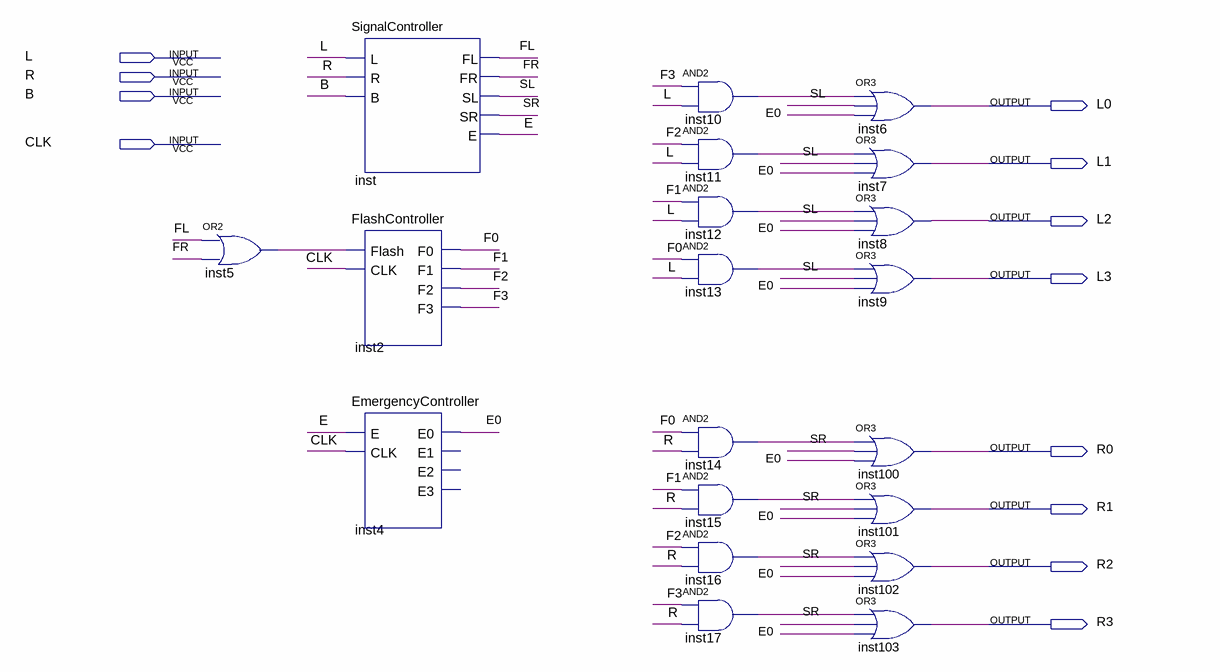
[diagram p0: schematic sheet]
// Quartus schematic MainControlUnit.bdf as structural Verilog: 20 symbols, 12 pins
module MainControlUnit (
  input  L,
  input  R,
  input  B,
  input  CLK,
  output L0,
  output L1,
  output L2,
  output L3,
  output R0,
  output R1,
  output R2,
  output R3
);

  wire E, E0, F0, F1, F2, F3, FL, FR, inst5_out, inst10_out, inst11_out, inst12_out, inst13_out, inst14_out,
       inst15_out, inst16_out, inst17_out, SL, SR;

  or inst5 (inst5_out, FL, FR);
  SignalController inst (.L(L), .R(R), .B(B), .FL(FL), .FR(FR), .SL(SL), .SR(SR), .E(E));
  FlashController inst2 (.Flash(inst5_out), .CLK(CLK), .F0(F0), .F1(F1), .F2(F2), .F3(F3));
  EmergencyController inst4 (.E(E), .CLK(CLK), .E0(E0));  // open: E1, E2, E3
  and inst10 (inst10_out, F3, L);
  and inst11 (inst11_out, F2, L);
  and inst12 (inst12_out, F1, L);
  and inst13 (inst13_out, F0, L);
  and inst14 (inst14_out, F0, R);
  and inst15 (inst15_out, F1, R);
  and inst16 (inst16_out, F2, R);
  and inst17 (inst17_out, F3, R);
  or inst6 (L0, inst10_out, SL, E0);
  or inst7 (L1, inst11_out, SL, E0);
  or inst8 (L2, inst12_out, SL, E0);
  or inst9 (L3, inst13_out, SL, E0);
  or inst100 (R0, inst14_out, SR, E0);
  or inst101 (R1, inst15_out, SR, E0);
  or inst102 (R2, inst16_out, SR, E0);
  or inst103 (R3, inst17_out, SR, E0);
endmodule
